# EAGLE schematic shem (EAGLE 9.6.2)
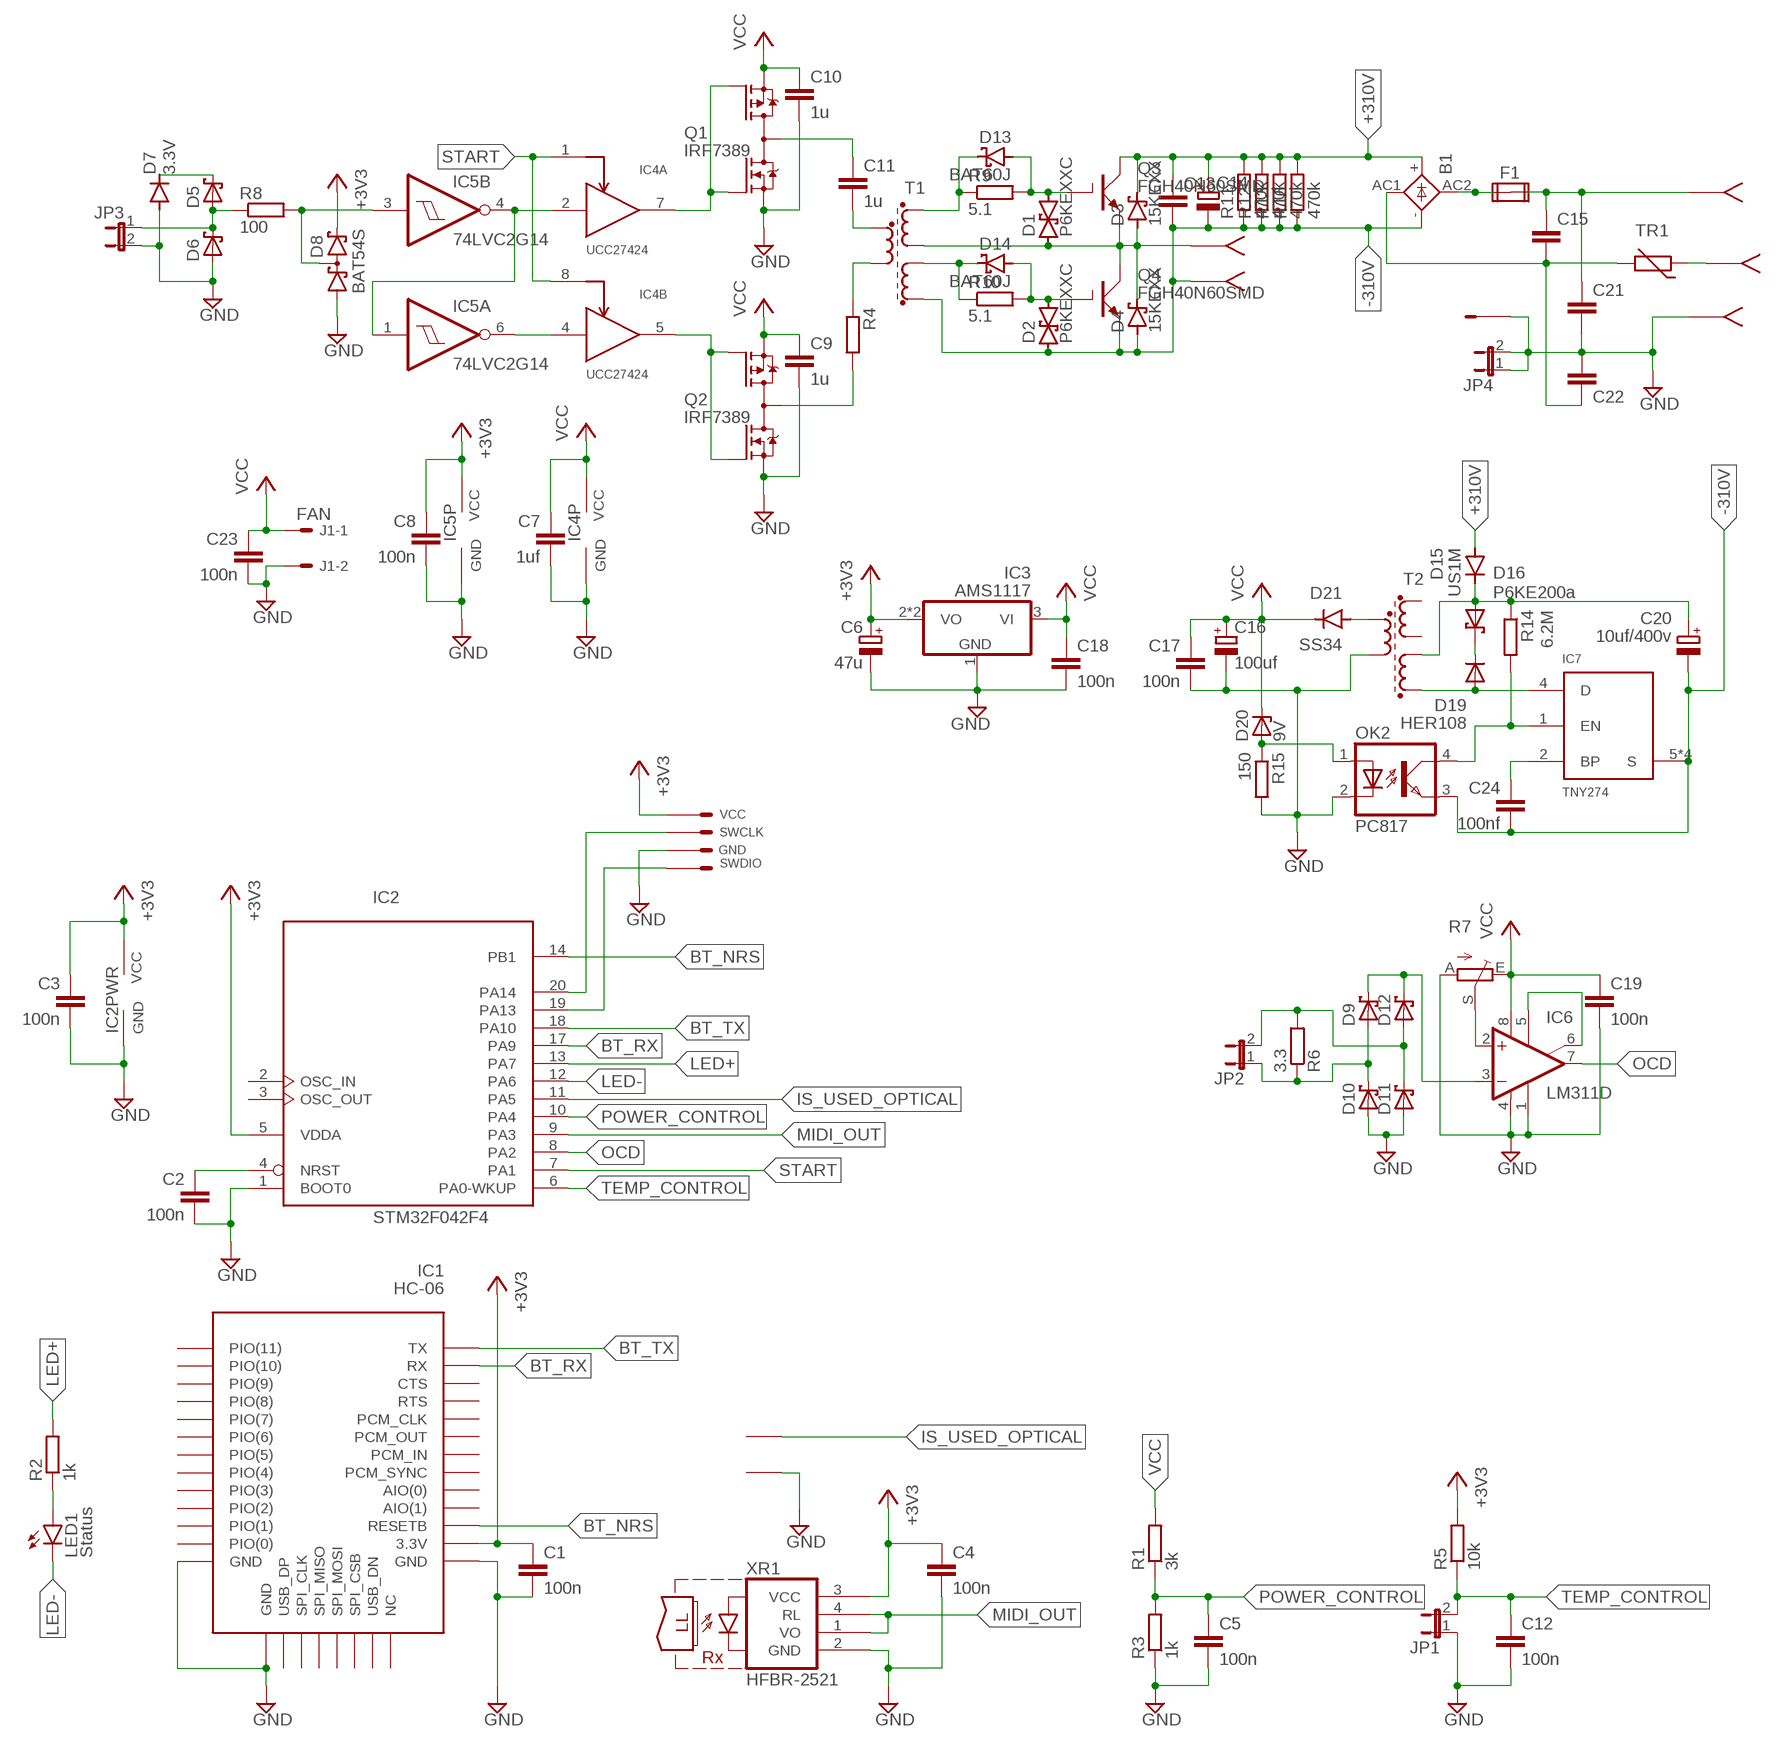
[diagram p0: schematic, sheet 1]

## Parts
B1  GBU4  [GBU4S]
C1  100n  CAP  [C0805]
C2  100n  CAP  [C0805]
C3  100n  CAP  [C0805]
C4  100n  CAP  [C0805]
C5  100n  CAP  [C0805]
C6  47u  CPOL-EUE2.5-6  [E2,5-6]
C7  1uf  CAP  [C0805]
C8  100n  CAP  [C0805]
C9  1u  CAP  [C0805]
C10  1u  CAP  [C0805]
C11  1u  CAP  [C0805]
C12  100n  CAP  [C0805]
C13  C-EU225-074X268  [C225-074X268]
C14  CPOL-EUE10-25  [EB25D]
C15  C-EU150-072X183  [C150-072X183]
C16  100uf  CPOL-EUE2.5-7  [E2,5-7]
C17  100n  CAP  [C0805]
C18  100n  CAP  [C0805]
C19  100n  CAP  [C0805]
C20  10uf/400v  CPOL-EUE3.5-8  [E3,5-8]
C21  CAP_5/7  [C5/7]
C22  CAP_5/7  [C5/7]
C23  100n  CAP  [C0805]
C24  100nf  CAP  [C0805]
D1  P6KEXXC  [CB417-15]
D2  P6KEXXC  [CB417-15]
D3  15KEXX  [CB429-17]
D4  15KEXX  [CB429-17]
D5  SHOTTKY_DIODE  [S0D-123]
D6  SHOTTKY_DIODE  [S0D-123]
D7  3.3V  DIODE-MINIMELF  [MINIMELF]
D8  BAT54S  BAS70-04  [SOT23]
D9  SHOTTKY_DIODE  [S0D-123]
D10  SHOTTKY_DIODE  [S0D-123]
D11  SHOTTKY_DIODE  [S0D-123]
D12  SHOTTKY_DIODE  [S0D-123]
D13  BAT60J  [SOD323_ST]
D14  BAT60J  [SOD323_ST]
D15  US1M  DIODE-DO-214AC  [DO-214AC]
D16  P6KE200a  SUP_A_DO27'  [DO-15W]
D19  HER108  DIODE_DO-41  [DO-41W]
D20  9V  ZENER_DIODE""  [MINIMELF]
D21  SS34  DIODE-DO-214AC  [DO-214AC]
F1  FUSE2P  [FUSE1]
IC1  HC-06  [BLUETOOTH]
IC2  STM32F042F4  STM32F030F4  [TSSOP-20]
IC3  AMS1117  [SOT223]
IC4  UCC27424  [SO08]
IC5  74LVC2G14  74LVC2G14'  [SOT23-6]
IC6  LM311D  [SO08]
IC7  TNY274  TNY274'''  [DIL07]
J1  FAN  22-27-2021-02  [6410-02]
JP1  JP1E  [JP1]
JP2  JP1E  [JP1]
JP3  JP1E  [JP1]
JP4  JP1E  [JP1]
LED1  Status  LED3MM  [LED3MM]
OK2  PC817  LTV816S  [DIL4-SMD]
Q1  IRF7389  [SO08]
Q2  IRF7389  [SO08]
Q3  FGH40N60SMD  [TO247BV]
Q4  FGH40N60SMD  [TO247BV]
R1  3k  RES  [R0805]
R2  1k  RES  [R0805]
R3  1k  RES  [R0805]
R4  R-EU_0414/5V  [0414V]
R5  10k  RES  [R0805]
R6  3.3  RES  [R0805]
R7  TRIM_EU-B64Y  [B64Y]
R8  100  RES  [R0805]
R9  5.1  RES  [R0805]
R10  5.1  RES  [R0805]
R11  470k  RES_0603""  [1206]
R12  470k  RES_0603""  [1206]
R13  470k  RES_0603""  [1206]
R14  6.2M  RES  [R0805]
R15  150  RES  [R0805]
R16  470k  RES_0603""  [1206]
T1  GDT-2  [GDT-2]
T2  PULSE_TRANS  [PULSE_TRANS]
TR1  TR  [R-7,5]
U$1  SWD  [SWD]
U$2  CLEM  [CLEM]
U$3  CLEM  [CLEM]
U$4  CLEM  [CLEM]
U$5  CLEM  [CLEM]
U$6  CLEM  [CLEM]
U$7  SECONDARY  [SECONDARY]
XR1  HFBR-2521  [HFBR-15X3]

## Nets
+3V3: C1.1 C3.1 C4.1 C6.+ C8.1 D8.2(C2) IC1.12(3.3V) IC2.5(VDDA) IC2.16(VCC) IC3.2(VO) IC3.4(VO) IC5.5(P:VCC) R5.2 U$1.VCC XR1.3(VCC)
+310V: B1.+ C13.1 C14.+ D3.C D15.A Q3.D(C) R11.2 R12.2 R13.2 R16.2
-310V: B1.- C13.2 C14.- C20.- C24.2 D2.A D4.A IC7.5(S) IC7.6(S) IC7.7(S) IC7.8(S) OK2.3(EMIT) Q4.S(E) R11.1 R12.1 R13.1 R16.1 T1.OUT2A U$3.P$1 U$3.P$2
BT_NRS: IC1.11(RESETB) IC2.14(PB1)
BT_RX: IC1.2(RX) IC2.17(PA9)
BT_TX: IC1.1(TX) IC2.18(PA10)
GND: C1.2 C2.2 C3.2 C4.2 C5.2 C6.- C7.2 C8.2 C9.2 C10.2 C12.2 C16.- C17.2 C18.2 C19.2 C21.2 C21.3 C22.2 C22.3 C23.2 D6.A D7.A D8.1(A1) D10.A D11.A IC1.13(GND) IC1.21(GND) IC1.22(GND) IC2.1(BOOT0) IC2.15(GND) IC3.1(GND) IC4.3(P:GND) IC5.2(P:GND) IC6.1(GND) IC6.4(V-) J1.2 JP1.1 JP3.2 JP4.1 JP4.2 OK2.2(C) Q1.1(N-S) Q2.1(N-S) R3.1 R7.A R15.2 T2.C2 U$1.GND U$6.P$1 U$6.P$2 U$7.1 XR1.2(GND) XR1.5
IS_USED_OPTICAL: IC2.11(PA5) XR1.8
LED+: IC2.13(PA7) R2.2
LED-: IC2.12(PA6) LED1.K(C)
MIDI_OUT: IC2.9(PA3) XR1.1(VO) XR1.4(RL)
N$1: C2.1 IC2.4(NRST)
N$2: LED1.A R2.1
N$3: IC2.19(PA13) U$1.SWDIO
N$4: IC2.20(PA14) U$1.SWCLK
N$5: IC4.5(B:OUT) Q2.2(N-G) Q2.4(P-G)
N$6: IC4.4(B:IN) IC5.6(A:O)
N$7: IC4.2(A:IN) IC5.1(A:I) IC5.4(B:O)
N$8: IC4.7(A:OUT) Q1.2(N-G) Q1.4(P-G)
N$9: R4.1 T1.IN_A(IN_B)
N$10: Q2.5(D) Q2.6(D) Q2.7(D) Q2.8(D) R4.2
N$11: C11.2 T1.IN_B(INA)
N$12: C11.1 Q1.5(D) Q1.6(D) Q1.7(D) Q1.8(D)
N$13: D9.A D10.C JP2.1 R6.1
N$14: D1.A D3.A D4.C Q3.S(E) Q4.D(C) T1.OUT1B U$2.P$1 U$2.P$2
N$15: TR1.1 U$5.P$1 U$5.P$2
N$17: D8.3(C1A2) IC5.3(B:I) R8.2
N$18: B1.AC2(AC1) F1.2A F1.2B
N$19: C15.1 C21.1 F1.1A F1.1B U$4.P$1 U$4.P$2
N$20: B1.AC1(AC2) C15.2 C22.1 TR1.2
N$21: D5.A D6.C JP3.1 R8.1
N$22: D11.C D12.A JP2.2 R6.2
N$23: D5.C D7.C
N$24: D9.C D12.C IC6.3(-IN)
N$25: D21.A T2.C1
N$26: IC6.5(ON) IC6.6(ON/STR)
N$27: IC6.2(+IN) R7.S
N$28: D13.C R9.1 T1.OUT1A
N$29: D1.C D13.A Q3.G R9.2
N$30: D14.C R10.1 T1.OUT2B
N$31: D2.C D14.A Q4.G R10.2
N$35: C24.1 IC7.2(BP)
N$36: D20.A OK2.1(A) R15.1
N$37: IC7.1(EN) OK2.4(COL) R14.2
N$38: D19.A IC7.4(D) T2.B2
N$39: C20.+ D15.C D16.A R14.1 T2.B1
N$40: D16.C D19.C
OCD: IC2.8(PA2) IC6.7(OUT)
POWER_CONTROL: C5.1 IC2.10(PA4) R1.1 R3.2
START: IC2.7(PA1) IC4.1(A:ENB) IC4.8(B:ENB)
TEMP_CONTROL: C12.1 IC2.6(PA0-WKUP) JP1.2 R5.1
VCC: C7.1 C9.1 C10.1 C16.+ C17.1 C18.1 C19.1 C23.1 D20.C D21.C IC3.3(VI) IC4.6(P:VCC) IC6.8(V+) J1.1 Q1.3(P-S) Q2.3(P-S) R1.2 R7.E
Unconnected: IC1.3(CTS) IC1.4(RTS) IC1.5(PCM_CLK) IC1.6(PCM_OUT) IC1.7(PCM_IN) IC1.8(PCM_SYNC) IC1.9(AIO(0)) IC1.10(AIO(1)) IC1.14(NC) IC1.15(USB_DN) IC1.16(SPI_CSB) IC1.17(SPI_MOSI) IC1.18(SPI_MISO) IC1.19(SPI_CLK) IC1.20(USB_DP) IC1.23(PIO(0)) IC1.24(PIO(1)) IC1.25(PIO(2)) IC1.26(PIO(3)) IC1.27(PIO(4)) IC1.28(PIO(5)) IC1.29(PIO(6)) IC1.30(PIO(7)) IC1.31(PIO(8)) IC1.32(PIO(9)) IC1.33(PIO(10)) IC1.34(PIO(11)) IC2.2(OSC_IN) IC2.3(OSC_OUT) T2.A1 T2.A2

## Library data of the parts
B1 = rectifier:GBU4: GENERAL INSTRUMENT RECTIFIER
C1-C5 C7-C12 C17-C19 C23 C24 = myRlc:CAP
C6 C14 C16 = rcl:CPOL-EU: POLARIZED CAPACITOR, European symbol; SPICEPREFIX: C
C13 C15 = rcl:C-EU: CAPACITOR, European symbol; SPICEPREFIX: C
C20 = resistor:CPOL-EU: POLARIZED CAPACITOR, European symbol
C21 C22 = onecoil:CAP_5/7
D1 D2 = diode:P6KEXXC: DIODE transient-voltage suppressor
D3 D4 = diode:15KEXX: DIODE
D5 D6 D9-D12 = onecoil:SHOTTKY_DIODE
D7 D15 D21 = diode:DIODE-: DIODE
D8 = diode:BAS70-04: Silicon Schottky Diodes General-purpose diode for high-speed switching
D13 D14 = diode:BAT60J: Schottky barrier diode Source: www.st.com, BAT60J.pdf
D16 = onecoil:SUP_A_DO27
D19 = onecoil:DIODE_DO-41
D20 = onecoil:ZENER_DIODE
F1 = special:FUSE2P: FUSE 5 x 20 mm
IC1 = inter:HC-06
IC2 = inter:STM32F030F4
IC3 = inter:AMS1117
IC4 = inter:UCC27424
IC5 = inter:74LVC2G14
IC6 = mylinear:LM311: COMPARATOR
IC7 = onecoil:TNY274
J1 = con-molex:22-?-02: CONNECTOR wire to board 2.54 mm (.1 inch) pitch header; MF: MOLEX; OC_FARNELL: unknown; OC_NEWARK: unknown
JP1-JP4 = jumper:JP1E: JUMPER
LED1 = led:LED: LED OSRAM: - CHIPLED LG R971, LG N971, LY N971, LG Q971, LY Q971, LO R971, LY R971 LH N974, LH R974 LS Q976, LO Q976, LY Q976 LO Q996 - Hyper CHIPLED LW Q18S LB Q993, LB Q99A, LB R99A - SideLED LS A670, LO A670, LY A670, LG A670, LP A670 LB A673, LV A673, LT A673, LW A673 LH A674 LY A675 LS A676, LA A676, LO A676, LY A676, LW A676 LS A679, LY A679, LG A679 - Hyper Micro SIDELED® LS Y876, LA Y876, LO Y876, LY Y876 LT Y87S - SmartLED LW L88C, LW L88S LB L89C, LB L89S, LG L890 LS L89K, LO L89K, LY L89K LS L896, LA L896, LO L896, LY L896 - TOPLED LS T670, LO T670, LY T670, LG T670, LP T670 LSG T670, LSP T670, LSY T670, LOP T670, LYG T670 LG T671, LOG T671, LSG T671 LB T673, LV T673, LT T673, LW T673 LH T674 LS T676, LA T676, LO T676, LY T676, LB T676, LH T676, LSB T676, LW T676 LB T67C, LV T67C, LT T67C, LS T67K, LO T67K, LY T67K, LW E67C LS E67B, LA E67B, LO E67B, LY E67B, LB E67C, LV E67C, LT E67C LW T67C LS T679, LY T679, LG T679 LS T770, LO T770, LY T770, LG T770, LP T770 LB T773, LV T773, LT T773, LW T773 LH T774 LS E675, LA E675, LY E675, LS T675 LS T776, LA T776, LO T776, LY T776, LB T776 LHGB T686 LT T68C, LB T68C - Hyper Mini TOPLED® LB M676 - Mini TOPLED Santana® LG M470 LS M47K, LO M47K, LY M47K Source: http://www.osram.convergy.de LUXEON: - LUMILED® LXK2-PW12-R00, LXK2-PW12-S00, LXK2-PW14-U00, LXK2-PW14-V00 LXK2-PM12-R00, LXK2-PM12-S00, LXK2-PM14-U00 LXK2-PE12-Q00, LXK2-PE12-R00, LXK2-PE12-S00, LXK2-PE14-T00, LXK2-PE14-U00 LXK2-PB12-K00, LXK2-PB12-L00, LXK2-PB12-M00, LXK2-PB14-N00, LXK2-PB14-P00, LXK2-PB14-Q00 LXK2-PR12-L00, LXK2-PR12-M00, LXK2-PR14-Q00, LXK2-PR14-R00 LXK2-PD12-Q00, LXK2-PD12-R00, LXK2-PD12-S00 LXK2-PH12-R00, LXK2-PH12-S00 LXK2-PL12-P00, LXK2-PL12-Q00, LXK2-PL12-R00 Source: www.luxeon.com KINGBRIGHT: KA-3528ASYC Source: www.kingbright.com
OK2 = optocoupler:LTV816: OPTO COUPLER Source: LITEON, LTV816.pdf
Q1 Q2 = myTransistor-fet:IRF7389: Complimentary Half Bridge HEXFET Power MOSFET Source: http://www.irf.com/product-info/datasheets/data/irf7389.pdf
Q3 Q4 = onecoil:FGH40N60SMD
R1-R3 R5 R6 R8-R10 R14 R15 = myRlc:RES
R4 = rcl:R-EU_: RESISTOR, European symbol; SPICEPREFIX: R
R7 = pot:TRIM_EU-: POTENTIOMETER
R11-R13 R16 = inter:RES_0603
T1 = onecoil:GDT-2
T2 = onecoil:PULSE_TRANS
TR1 = onecoil:TR
U$1 = inter:SWD
U$2-U$6 = onecoil:CLEM
U$7 = onecoil:SECONDARY
XR1 = inter:HFBR-2521: RECEIVER 5-MBd high performance link, horizontal; MF: AGILENT TECHNOLOGIES; MPN: HFBR-2521; OC_FARNELL: 1173131; OC_NEWARK: 06F6091

## Net classes
0 default: width 0.25 mm
1 VCC: width 0.3 mm
2 +9V: width 0.6 mm